# EAGLE design enabtmr (EAGLE 5.03)
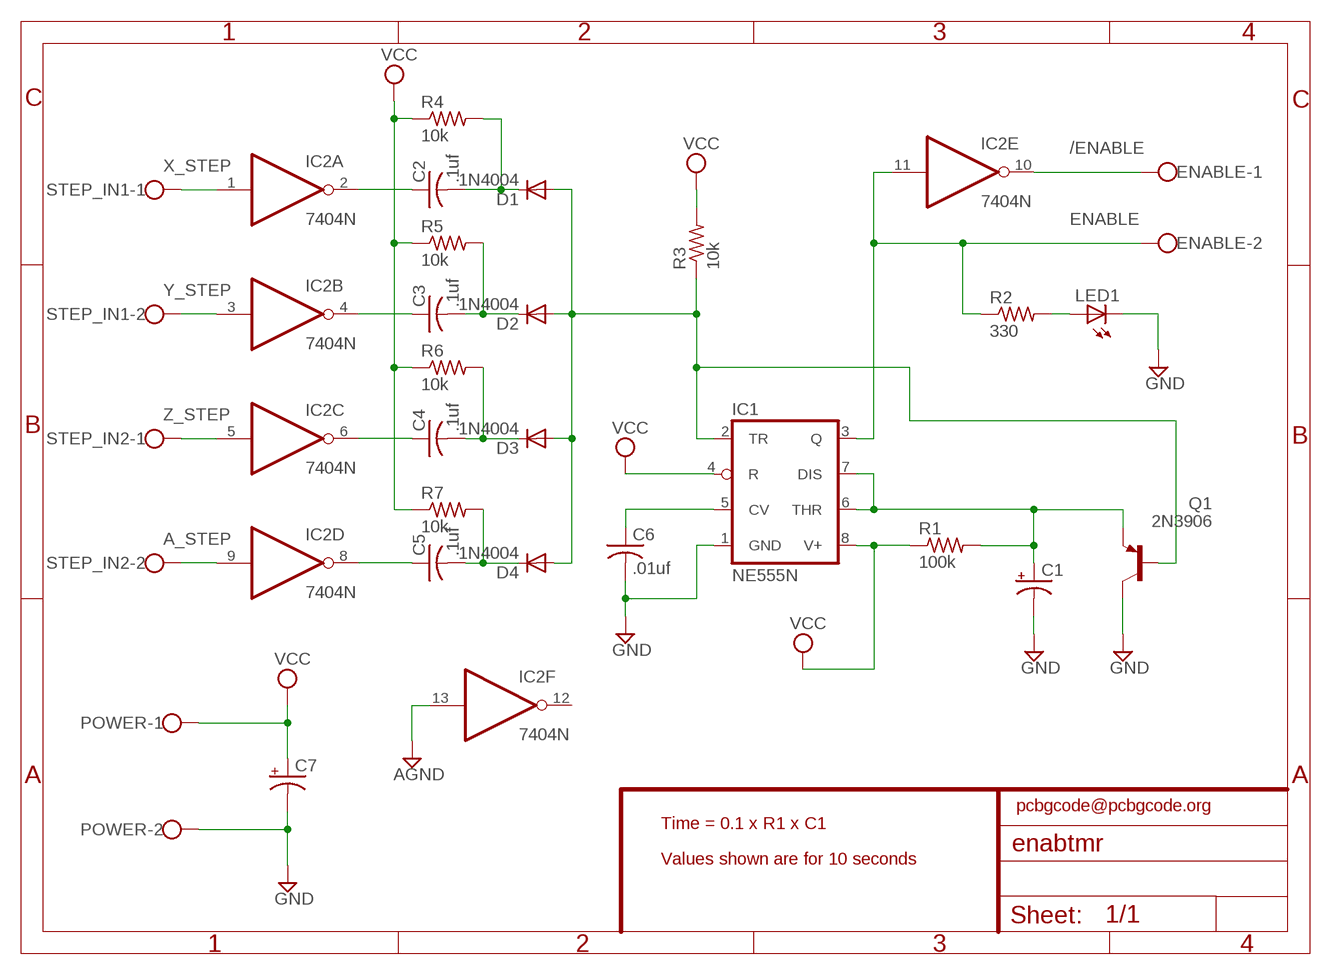
[diagram p0: schematic, sheet 1]

## Parts
C1  CPOL-USE15-5AXIAL  [E15-5]
C2  .1uf  C-US050-030X075  [C050-030X075]
C3  .1uf  C-US050-030X075  [C050-030X075]
C4  .1uf  C-US050-030X075  [C050-030X075]
C5  .1uf  C-US050-030X075  [C050-030X075]
C6  .01uf  C-US050-030X075  [C050-030X075]
C7  CPOL-USE15-5AXIAL  [E15-5]
D1  1N4004  [DO41-10]
D2  1N4004  [DO41-10]
D3  1N4004  [DO41-10]
D4  1N4004  [DO41-10]
ENABLE  W237-102  [W237-102]
IC1  NE555N  [DIL08]
IC2  7404N  [DIL14]
LED1  LED5MM  [LED5MM]
POWER  W237-102  [W237-102]
Q1  2N3906  [TO92]
R1  100k  R-US_0207/12  [0207/12]
R2  330  R-US_0207/12  [0207/12]
R3  10k  R-US_0207/12  [0207/12]
R4  10k  R-US_0207/12  [0207/12]
R5  10k  R-US_0207/12  [0207/12]
R6  10k  R-US_0207/12  [0207/12]
R7  10k  R-US_0207/12  [0207/12]
STEP_IN1  W237-102  [W237-102]
STEP_IN2  W237-102  [W237-102]

## Nets
/ENABLE: ENABLE.1 IC2.10(E:O)
A_STEP: IC2.9(D:I) STEP_IN2.2
AGND: IC2.13(F:I)
ENABLE: ENABLE.2 IC1.3(Q) IC2.11(E:I) R2.1
GND: C1.- C6.2 C7.- IC1.1(GND) LED1.K(C) POWER.2 Q1.1(C)
N$2: C6.1 IC1.5(CV)
N$3: D1.A D2.A D3.A D4.A IC1.2(TR) Q1.2(B) R3.1
N$4: C2.1 IC2.2(A:O)
N$5: C3.1 IC2.4(B:O)
N$6: C4.1 IC2.6(C:O)
N$7: C5.1 IC2.8(D:O)
N$8: C5.2 D4.C R7.2
N$9: C4.2 D3.C R6.2
N$10: C3.2 D2.C R5.2
N$11: C2.2 D1.C R4.2
N$19: LED1.A R2.2
N$20: C1.+ IC1.6(THR) IC1.7(DIS) Q1.3(E) R1.2
VCC: C7.+ IC1.4(R) IC1.8(V+) POWER.1 R1.1 R3.2 R4.1 R5.1 R6.1 R7.1
X_STEP: IC2.1(A:I) STEP_IN1.1
Y_STEP: IC2.3(B:I) STEP_IN1.2
Z_STEP: IC2.5(C:I) STEP_IN2.1
Unconnected: IC2.12(F:O)

## Notes on the sheet
- pcbgcode@pcbgcode.org
- Time = 0.1 x R1 x C1
- Values shown are for 10 seconds

## Power pins joined to a net without a drawn wire
GND: IC2.7(P:GND)
VCC: IC2.14(P:VCC)

## Library data of the parts
C1 C7 = rcl:CPOL-US: POLARIZED CAPACITOR, American symbol
C2-C6 = rcl:C-US: CAPACITOR, American symbol
D1-D4 = diode:1N4004: DIODE general purpose rectifier, 1 A
ENABLE POWER STEP_IN1 STEP_IN2 = con-wago-500:W237-102: WAGO SCREW CLAMP
IC1 = linear:*555: TIMER
IC2 = 74xx-us:74*04: Hex INVERTER
LED1 = led:LED: LED OSRAM: - CHIPLED LG R971, LG N971, LY N971, LG Q971, LY Q971, LO R971, LY R971 LH N974, LH R974 LS Q976, LO Q976, LY Q976 LO Q996 - Hyper CHIPLED LW Q18S LB Q993, LB Q99A, LB R99A - SideLED LS A670, LO A670, LY A670, LG A670, LP A670 LB A673, LV A673, LT A673, LW A673 LH A674 LY A675 LS A676, LA A676, LO A676, LY A676, LW A676 LS A679, LY A679, LG A679 - Hyper Micro SIDELED® LS Y876, LA Y876, LO Y876, LY Y876 LT Y87S - SmartLED LW L88C, LW L88S LB L89C, LB L89S, LG L890 LS L89K, LO L89K, LY L89K LS L896, LA L896, LO L896, LY L896 - TOPLED LS T670, LO T670, LY T670, LG T670, LP T670 LSG T670, LSP T670, LSY T670, LOP T670, LYG T670 LG T671, LOG T671, LSG T671 LB T673, LV T673, LT T673, LW T673 LH T674 LS T676, LA T676, LO T676, LY T676, LB T676, LH T676, LSB T676, LW T676 LB T67C, LV T67C, LT T67C, LS T67K, LO T67K, LY T67K, LW E67C LS E67B, LA E67B, LO E67B, LY E67B, LB E67C, LV E67C, LT E67C LW T67C LS T679, LY T679, LG T679 LS T770, LO T770, LY T770, LG T770, LP T770 LB T773, LV T773, LT T773, LW T773 LH T774 LS E675, LA E675, LY E675, LS T675 LS T776, LA T776, LO T776, LY T776, LB T776 LHGB T686 LT T68C, LB T68C - Hyper Mini TOPLED® LB M676 - Mini TOPLED Santana® LG M470 LS M47K, LO M47K, LY M47K Source: http://www.osram.convergy.de/
Q1 = transistor-pnp:2N3906: PNP Transistor
R1-R7 = rcl:R-US_: RESISTOR, American symbol

## Net classes
0 default: width 1.27 mm, clearance 0.508 mm

## Board
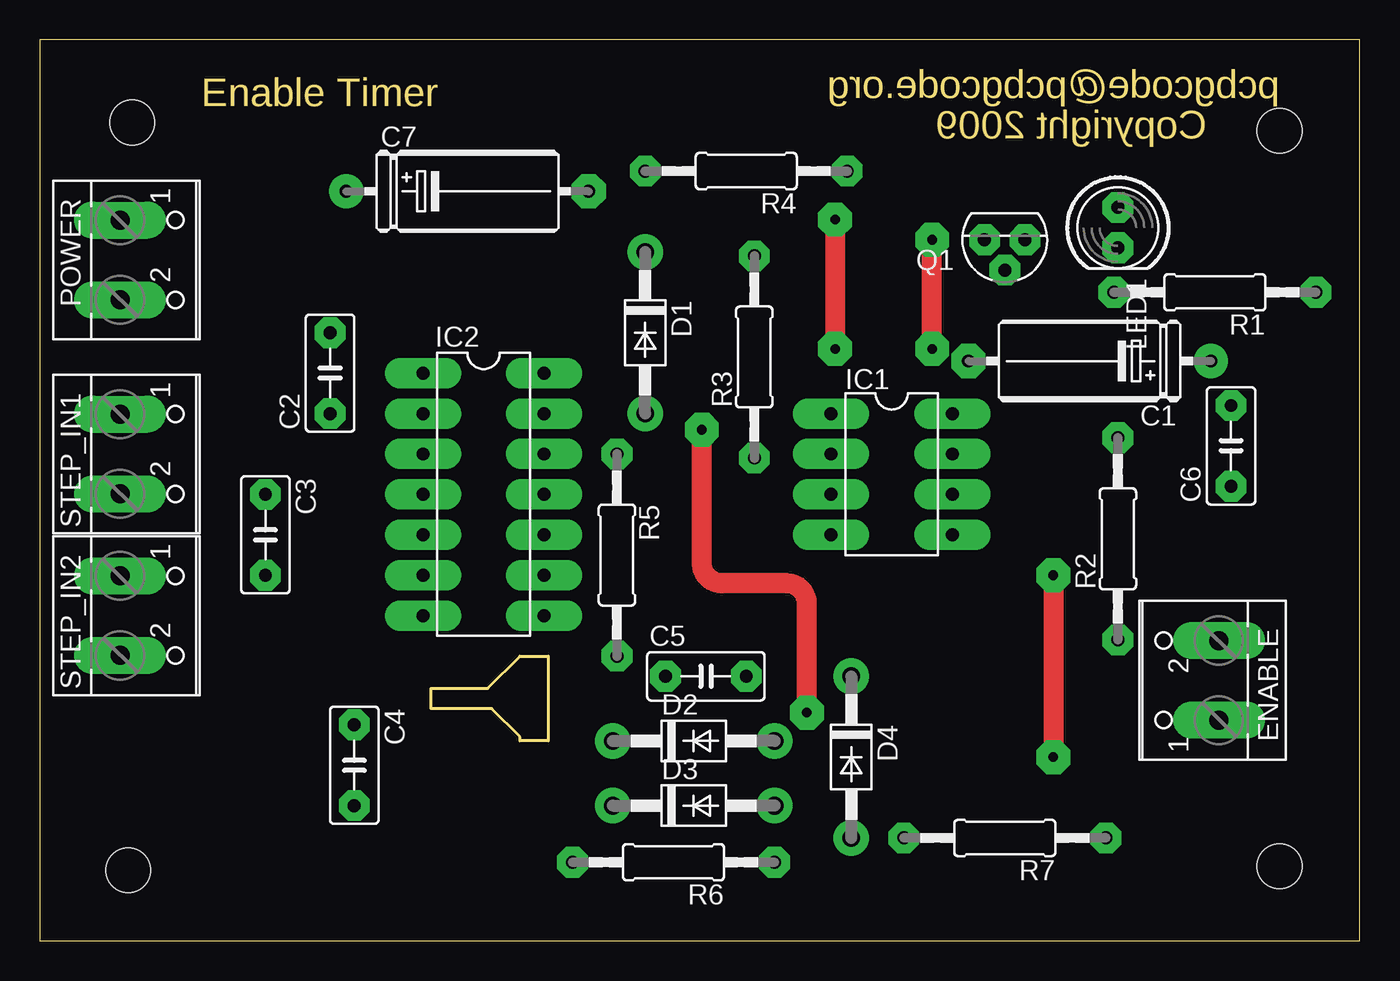
[diagram p1: board, top side]
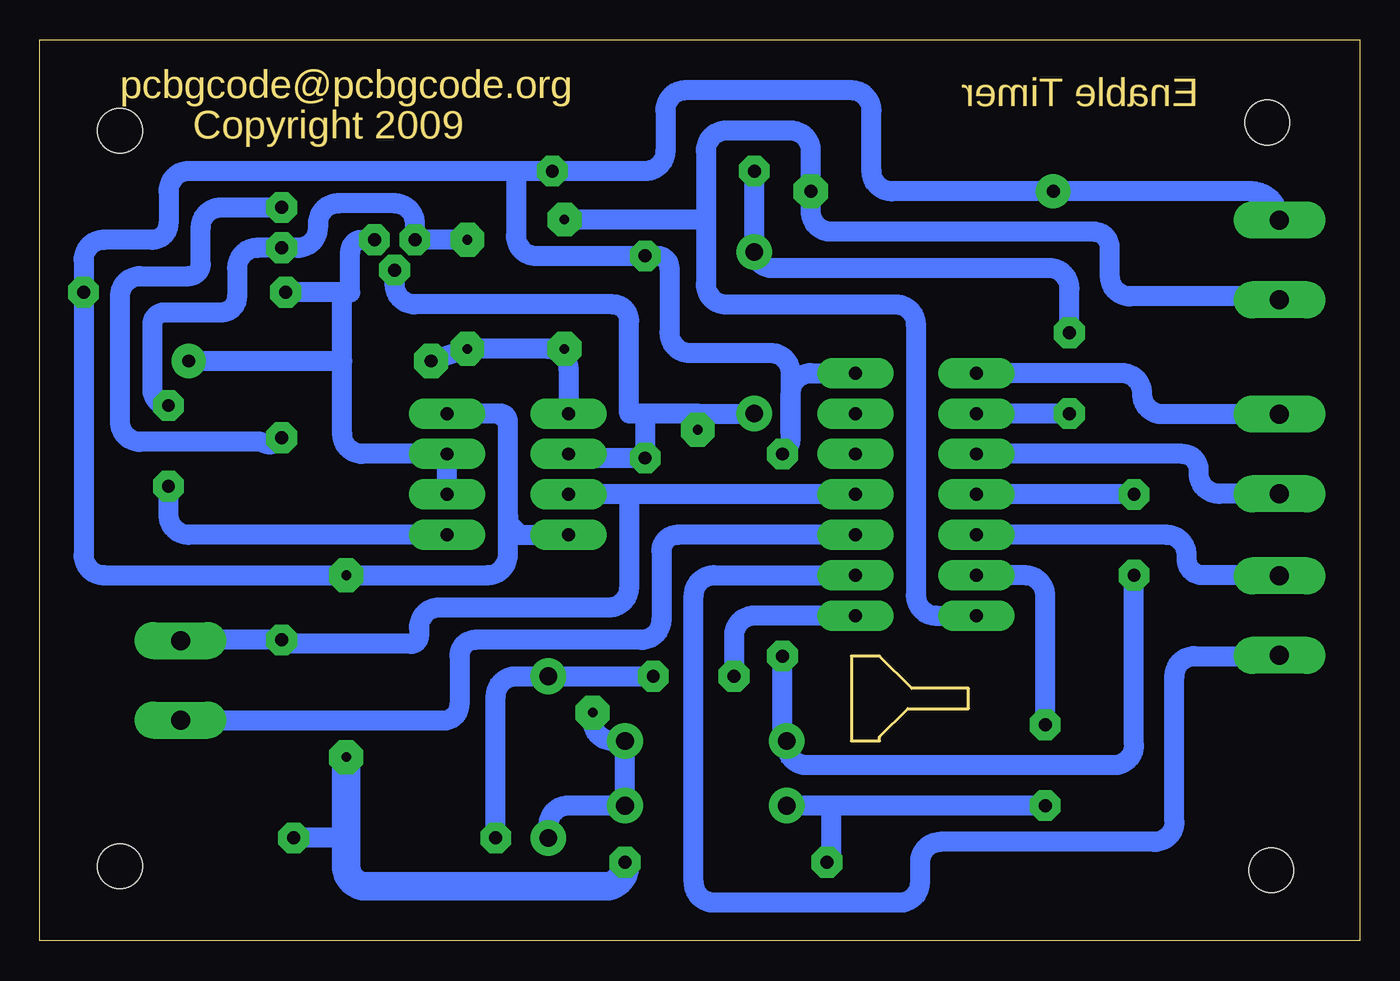
[diagram p2: board, bottom side, seen from below]

Size 82.98 x 56.63 mm. Coordinates in mm from the lower left corner, seen from the top.
Outline: 0,0 82.98,0 82.98,56.63 0,56.63 0,0
Copper layers (1*16): Top 0.035mm / dielectric 1.5mm / Bottom 0.035mm
Design rules "default": minimum track width 30mil, minimum drill 22mil, track to track 20mil, track to pad 20mil, pad to pad 10mil, via to via 8mil, smd to smd 8mil, copper to edge 40mil, drill to drill 30mil, minimum pad ring 22mil, minimum via ring 30mil, stop-mask expansion 4mil, vias tented up to drill 0mil, thermal gap 10mil
Holes 2.8 mm at 5.55,4.44 5.8,51.43 77.94,50.92 77.94,4.69
Milling: 9 lines

### Footprints (pad centres in the part's own frame; a part is rotated, then mirrored left to right if it is on the bottom)
E15-5 = drill 0.813 pad 2.159 round: + -7.62,0 | drill 0.813 pad 2.159 octagon: - 7.62,0
C050-030X075 = drill 0.813 octagon: 1 -2.54,0; 2 2.54,0
DO41-10 = drill 1.118 round: A 5.08,0; C -5.08,0
W237-102 = drill 1.194 long: 1 -2.5,-1.27; 2 2.5,-1.27
DIL08 = drill 0.813 long: 1 -3.81,-3.81; 2 -1.27,-3.81; 3 1.27,-3.81; 4 3.81,-3.81; 5 3.81,3.81; 6 1.27,3.81; 7 -1.27,3.81; 8 -3.81,3.81
DIL14 = drill 0.813 long: 1 -7.62,-3.81; 2 -5.08,-3.81; 3 -2.54,-3.81; 4 0,-3.81; 5 2.54,-3.81; 6 5.08,-3.81; 7 7.62,-3.81; 8 7.62,3.81; 9 5.08,3.81; 10 2.54,3.81; 11 0,3.81; 12 -2.54,3.81; 13 -5.08,3.81; 14 -7.62,3.81
LED5MM = drill 0.813 octagon: A -1.27,0; K 1.27,0
TO92 = drill 0.813 octagon: 1 1.27,0; 2 0,1.905; 3 -1.27,0
0207/12 = drill 0.813 octagon: 1 -6.35,0; 2 6.35,0

### Placement (x,y rotation side)
C1  66,36.44 180 top
C2  18.25,35.68 90 top
C3  14.19,25.52 270 top
C4  19.77,11.04 270 top
C5  41.87,16.63 0 top
C6  74.89,31.11 90 top
C7  26.89,47.11 0 top
D1  38.06,38.22 270 top
D2  41.11,12.57 0 top
D3  41.11,8.5 0 top
D4  51.02,11.55 270 top
ENABLE  72.86,16.38 90 top
IC1  53.56,29.33 270 top
IC2  27.9,28.06 270 top
LED1  67.78,44.83 270 top
POWER  6.31,42.79 270 top
Q1  60.67,44.06 180 top
R1  73.88,40.76 180 top
R2  67.78,25.27 90 top
R3  44.92,36.7 90 top
R4  44.41,48.38 180 top
R5  36.28,24.25 270 top
R6  39.84,4.95 180 top
R7  60.67,6.47 180 top
STEP_IN1  6.31,30.6 270 top
STEP_IN2  6.31,20.44 270 top

### Tracks (layer width: path | path; a pad name or v marks a point on that pad's centre or on a via)
/ENABLE
  Bottom 1.27: 73.88,14.35 73.92,14.39 ENABLE.1 | ENABLE.1 74.13,14.35 | IC2.10 42.89,25.52 arc-90 43.9,24.51 43.9,20.19 arc90 45.17,18.92 55.59,18.92 arc-90 56.6,17.9 56.6,14.85 arc90 57.62,13.84 74.17,13.84 | 74.17,13.84 74.38,13.84 | 74.17,13.84 arc-90 ENABLE.1
A_STEP
  Bottom 1.27: IC2.9 40.6,22.98 arc-90 41.87,21.71 41.87,3.68 arc-90 40.6,2.41 28.92,2.41 arc-90 27.65,3.68 27.65,4.95 arc90 26.38,6.22 12.92,6.22 arc-90 11.65,7.49 11.65,16.63 arc90 10.38,17.9 5.3,17.9 arc90 5.26,17.94 STEP_IN2.2
ENABLE
  Bottom 1.27: IC2.11 45.94,28.06 | 45.94,28.06 IC1.3 | 45.94,28.06 45.94,22.22 arc90 47.21,20.95 57.87,20.95 arc-90 59.14,19.68 59.14,19.17 arc90 59.65,18.66 67.78,18.66 R2.1 74.38,18.92 arc-90 74.34,18.88 ENABLE.2
GND  (via drill 0.6)
  Top 1.27: v56.1,37.21 v56.1,44.06 | v50,45.33 v50,37.21
  Bottom 1.27: IC2.7 26.63,20.44 arc90 27.9,21.71 27.9,38.73 arc-90 29.17,40 39.84,40 arc90 41.11,41.27 41.11,45.08 | C7.- 34.51,49.4 | 41.11,45.08 41.11,45.33 49.75,45.33 arc90 v50,45.33 | 51.02,37.21 arc90 49.75,35.94 | 49.75,35.94 IC1.1 | C1.- v56.1,37.21 v50,37.21 51.02,37.21 | 51.02,37.21 arc90 49.75,35.94 | C7.- 34.51,45.84 arc-90 33.24,44.57 16.73,44.57 arc90 15.71,43.56 15.71,41.78 arc-90 14.44,40.51 5.08,40.51 arc-90 POWER.2 | C7.- 34.51,49.65 arc-90 35.78,50.92 39.84,50.92 arc-90 41.11,49.65 41.11,45.08 | C6.2 arc90 75.91,34.67 75.91,38.73 arc90 75.15,39.49 71.59,39.49 arc-90 70.57,40.51 70.57,42.29 arc90 69.3,43.56 LED1.K 66.76,43.56 arc-90 65.49,44.83 65.49,45.08 arc90 64.22,46.35 60.67,46.35 arc90 59.4,45.08 Q1.1 v56.1,44.06
N$2
  Bottom 1.27: IC1.5 73.62,25.52 arc90 74.89,26.79 C6.1
N$3  (via drill 0.6)
  Top 1.27: v48.22,14.35 48.22,21.2 arc90 46.95,22.47 42.89,22.47 arc-90 41.62,23.74 v41.62,32.13
  Bottom 1.27: 41.62,33.14 D1.A | 41.62,33.14 44.92,33.14 | 44.92,33.14 45.94,33.14 45.94,38.98 arc-90 46.95,40 59.4,40 arc90 60.67,41.27 Q1.2 | v41.62,32.13 41.62,33.14 | v48.22,14.35 48.22,13.84 arc-90 46.95,12.57 D2.A 46.44,12.31 46.19,12.06 D3.A 49.75,8.5 arc-90 51.02,7.23 D4.A | IC1.2 arc-90 49.49,30.35 R3.1 44.92,33.14
N$4
  Bottom 1.27: 24.35,33.14 IC2.2 C2.1
N$5
  Bottom 1.27: C3.1 IC2.4
N$6
  Bottom 1.27: IC2.6 21.04,22.98 arc90 19.77,21.71 C4.1
N$7
  Bottom 1.27: C5.1 39.33,19.17 arc90 38.06,20.44 IC2.8
N$8
  Bottom 1.27: C5.2 D4.C 53.05,16.63 arc-90 54.32,15.36 R7.2
N$9
  Bottom 1.27: C4.2 33.24,8.5 | 33.24,8.5 D3.C | R6.2 arc-90 33.24,5.2 33.24,8.5
N$10
  Bottom 1.27: R5.2 36.28,12.82 arc-90 D2.C 36.03,12.31 arc-90 34.76,11.04 15.46,11.04 arc-90 14.19,12.31 C3.2
N$11
  Bottom 1.27: R4.2 D1.C arc-90 36.79,42.29 19.52,42.29 arc90 18.25,41.02 C2.2
N$19
  Bottom 1.27: R2.2 arc90 69.05,31.36 76.67,31.36 arc90 77.94,32.63 77.94,40.51 arc90 76.67,41.78 73.62,41.78 arc-90 72.86,42.54 72.86,44.83 arc90 71.59,46.1 LED1.A
N$20
  Bottom 1.27: IC1.6 IC1.7 62.7,30.6 arc90 63.97,31.87 63.97,36.44 | 63.97,36.44 63.97,40.76 | 63.97,36.44 C1.+ | 63.97,40.76 R1.2 | Q1.3 62.7,44.06 arc-90 63.46,43.3 63.46,40.76 63.97,40.76
VCC  (via drill 0.6)
  Top 1.27: v63.72,22.98 v63.72,11.55
  Bottom 1.27: 50,25.27 IC1.4 52.79,25.52 53.56,26.28 53.56,26.79 | 53.56,26.79 53.56,32.63 | 53.56,32.63 54.06,33.14 | 57.62,33.14 IC1.8 54.06,33.14 | IC2.14 34.51,35.68 arc-90 35.78,34.41 35.78,31.87 | 35.78,31.87 35.78,35.68 arc-90 37.05,36.95 42.13,36.95 arc90 43.4,38.22 43.4,42.29 arc-90 44.16,43.05 R3.2 arc90 45.43,43.05 51.78,43.05 | 35.78,31.87 35.78,31.64 arc45 36.15,30.74 R5.1 | 53.05,48.38 R4.1 44.92,48.38 arc-90 43.65,49.65 43.65,52.19 arc90 42.38,53.46 31.97,53.46 arc90 30.7,52.19 30.7,48.38 | C7.+ arc-90 18.97,46.82 | C7.+ 29.43,47.11 | 29.43,47.11 arc90 30.7,48.38 | 53.05,44.32 arc-90 51.78,43.05 | 53.05,44.32 arc-90 51.78,43.05 | 53.05,48.38 53.05,44.32 | 29.43,47.11 arc90 30.7,48.38 | 54.83,22.98 arc-90 53.56,24.25 | 53.56,24.25 53.56,26.79 | 53.56,32.63 arc-90 54.06,33.14 | 53.56,24.25 53.56,32.63 | 54.83,22.98 arc-90 53.56,24.25 | 54.83,22.98 v63.72,22.98 78.96,22.98 arc90 80.23,24.25 R1.1 80.23,42.79 arc90 78.96,44.06 75.91,44.06 arc-90 74.89,45.08 74.89,47.11 arc90 73.62,48.38 53.05,48.38 | POWER.1 arc-90 6.86,47.11 C7.+ | 63.72,6.47 R7.1
  Bottom 1.778: R6.1 46.19,4.69 arc90 47.46,3.42 62.45,3.42 arc90 63.72,4.69 63.72,6.47 v63.72,11.55
X_STEP
  Bottom 1.27: STEP_IN1.1 12.41,33.1 arc90 13.68,34.37 13.68,34.41 arc-90 14.95,35.68 IC2.1
Y_STEP
  Bottom 1.27: STEP_IN1.2 8.85,28.1 arc90 10.12,29.37 10.12,29.59 arc-90 11.14,30.6 IC2.3
Z_STEP
  Bottom 1.27: IC2.5 12.15,25.52 arc90 10.88,24.25 10.88,24 arc-90 9.87,22.98 5.04,22.98 STEP_IN2.1

### Text on the board
Milling: Enable Timer | pcbgcode@pcbgcode.org | Copyright 2009